# Altium schematic sheet TEC power1.SchDoc
size A4
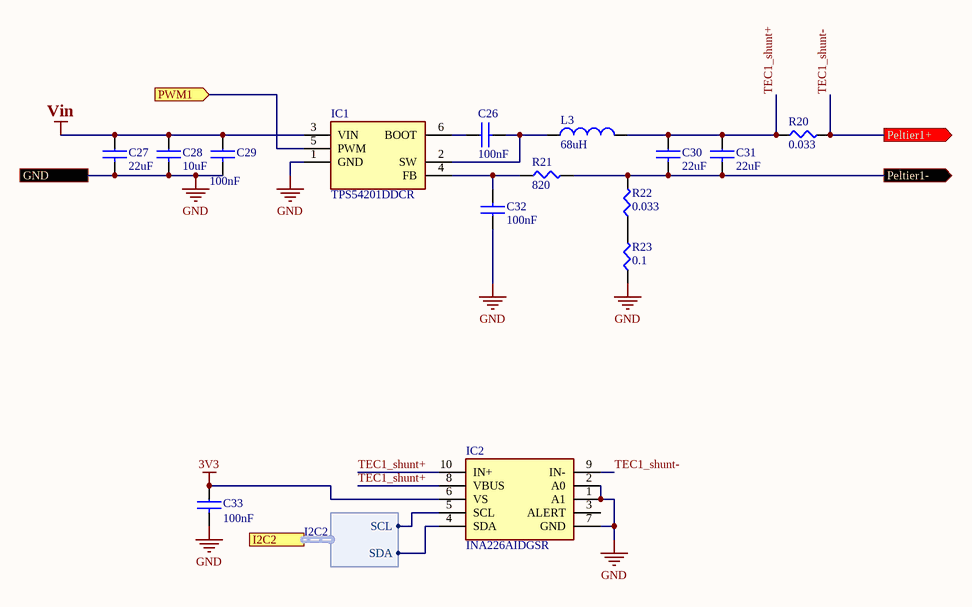
[diagram p0: TEC power1.SchDoc]

## Parts
C26  100nF  [CAPC160X80X90L35N]
C27  22uF  [CAPC200X125X110L50N]
C28  10uF  [CAPC200X125X110L50N]
C29  100nF  [CAPC160X80X90L35N]
C30  22uF  [CAPC200X125X110L50N]
C31  22uF  [CAPC200X125X110L50N]
C32  100nF  [CAPC160X80X90L35N]
C33  100nF  [CAPC160X80X90L35N]
IC1  TPS54201DDCR  [SOT95P280X110-6N]
IC2  INA226AIDGSR  [SOP10P50_300X490X110L55X22N]
L3  68uH  [INDM1250X1250X800L290X540N]
R20  0.033  [RESC200X125X70L40N]
R21  820  [RESC160X80X90L30N]
R22  0.033  [RESC200X125X70L40N]
R23  0.1  [RESC310X152X65L45N]

## Ports
GND, I2C2 (harness I2C2), Peltier1+ (out), Peltier1- (out), PWM1 (in)

## Harnesses
I2C2: SCL, SDA

## Nets
3V3: C33.1 IC2.6(VS)
GND: C27.2 C28.2 C29.2 C32.1 C33.2 IC1.1(GND) IC2.1(A1) IC2.2(A0) IC2.7(GND) R23.1 ; port GND
Vin: C27.1 C28.1 C29.1 IC1.3(VIN)
Peltier1-: C30.2 C31.2 R21.2 R22.2 ; port Peltier1-
PWM1: IC1.5(PWM) ; port PWM1
TEC1_shunt+: C30.1 C31.1 IC2.8(VBUS) IC2.10(IN+) L3.2 R20.1
TEC1_shunt-: IC2.9(IN-) R20.2 ; port Peltier1+
NetC26_1: C26.1 IC1.6(BOOT)
NetC26_2: C26.2 IC1.2(SW) L3.1
NetC32_2: C32.2 IC1.4(FB) R21.1
NetIC2_4: IC2.4(SDA) ; port I2C2.SDA
NetIC2_5: IC2.5(SCL) ; port I2C2.SCL
NetR22_1: R22.1 R23.2

Not connected (* = marked no-connect by the designer): IC2 3(ALERT)

## Library data of the parts
C26 C29 C32 C33 = capacitor: Part Number: CC0603KRX7R9BB104; Value: 100nF; LCSC Part #: C14663
C27 C30 C31 = capacitor: Part Number: CL21A226MAQNNNE; Value: 22uF; LCSC Part #: C45783
C28 = capacitor: Part Number: CL21A106KAYNNNE; Value: 10uF; LCSC Part #: C15850
IC1 = TPS54201DDCR_1: Integrated Circuit; Manufacturer_Name: Texas Instruments; Datasheet Link: http://www.ti.com/lit/gpn/TPS54201; Height: 1.1mm; Mouser2 Part Number: 595-TPS54201DDCR; Mouser2 Price/Stock: https://www.mouser.com/Search/Refine.aspx?Keyword=595-TPS54201DDCR; Manufacturer_Part_Number: TPS54201DDCR; Part Number: TPS54201; Parameter 1: *
IC2 = INA226AIDGSR: Integrated Circuit; Manufacturer_Name: Texas Instruments; Datasheet Link: https://componentsearchengine.com/Datasheets/1/INA226AIDGSR.pdf; Height: 1.1mm; Mouser2 Part Number: 595-INA226AIDGSR; Mouser2 Price/Stock: https://www.mouser.com/Search/Refine.aspx?Keyword=595-INA226AIDGSR; Manufacturer_Part_Number: INA226AIDGSR; LCSC Part #: C49851
L3 = Inductor: Part Number: SWRB1207S-680MT; Resistance: 0.14; Value: 68uH; Package: *; LCSC Part #: C169377
R20 = Resistor: Megjegyzes: Eredetileg ez egy: 0805, 0.05ohm, 0805W8F500MT5E; Value: 0.033; LCSC Part #: C127689; Package: Package0805
R21 = Resistor: Part Number: 0603WAF8200T5E; Value: 820; LCSC Part #: C23253
R22 = Resistor: Part Number: 0805W8F330MT5E; Value: 0.033; LCSC Part #: C127689; Package: 0805
R23 = Resistor: Part Number: 1206W4F100LT5E; Value: 0.1; LCSC Part #: C25334; Package: 1206